# Altium schematic sheet esp8266.SchDoc
size A; SPICEModelCacheEUEXJSGD: <root> / <DocumentId>EUEXJSGD</DocumentId> / </root>
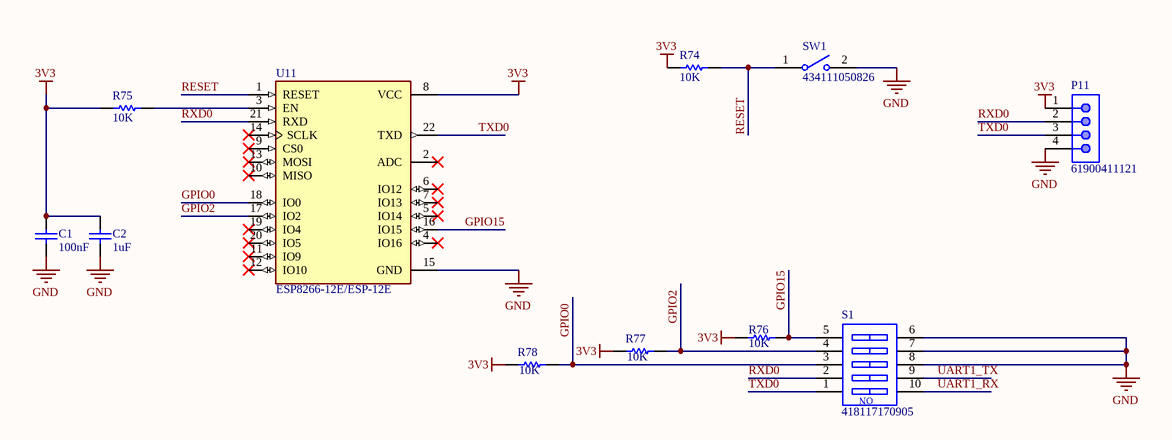
[diagram p0: esp8266.SchDoc]

## Parts
C1  value 100nF  [CAP-SM-0603]  (hidden comment: Cap Non-Pol SMD)
C2  value 1uF  [CAP-SM-0603]  (hidden comment: Cap Non-Pol SMD)
P11  61900411121  [61900411121]
R74  value 10K  [RES-SM-0603]  (hidden comment: RESISTOR SMD)
R75  value 10K  [RES-SM-0603]  (hidden comment: RESISTOR SMD)
R76  value 10K  [RES-SM-0603]  (hidden comment: RESISTOR SMD)
R77  value 10K  [RES-SM-0603]  (hidden comment: RESISTOR SMD)
R78  value 10K  [RES-SM-0603]  (hidden comment: RESISTOR SMD)
S1  418117170905  [418117170905]
SW1  434111050826  [WS-TASV_L6W3.5H5_4341x10508x6]
U11  ESP8266-12E/ESP-12E  [XCVR_ESP8266-12E/ESP-12E]

## Nets
3V3: C1.2 C2.2 P11.1 R74.1 R75.1 R76.2 R77.2 R78.2 U11.8(VCC)
GND: C1.1 C2.1 P11.4 S1.6 S1.7 S1.8 SW1.2 U11.15(GND)
GPIO0: R78.1 S1.3 U11.18(IO0)
GPIO2: R77.1 S1.4 U11.17(IO2)
GPIO15: R76.1 S1.5 U11.16(IO15)
RESET: R74.2 SW1.1 U11.1(RESET)
RXD0: P11.2 S1.2 U11.21(RXD)
TXD0: P11.3 S1.1 U11.22(TXD)
UART1_RX: S1.10
UART1_TX: S1.9
NetR75_2: R75.2 U11.3(EN)

Not connected (* = marked no-connect by the designer): U11 2(ADC)* 4(IO16)* 5(IO14)* 6(IO12)* 7(IO13)* 9(CS0)* 10(MISO)* 11(IO9)* 12(IO10)* 13(MOSI)* 14(SCLK)* 19(IO4)* 20(IO5)*

## Notes on the sheet
- (in symbol 418117170905) ON

## Library data of the parts
C1 C2 = Cap Non-Pol SMD: Capacitor
P11 = 61900411121: WR-WTB THT Male Vertical Locking Header, pitch 2.54mm, 4p; Pin Number: 4; Contact Resistance: 20mOhm; Rated Current: 3A; Withstanding Voltage: 1000VAC; Working Voltage: 250VAC; ComponentLink1Description: Manufacturer; ComponentLink1URL: http://www.we-online.de; ComponentLink2Description: Datasheet; ComponentLink2URL: https://www.we-online.com/catalog/datasheet/61900411121.pdf; Pitch: 2.54mm; Published Date: January 2020; Publisher: Wurth Elektronik; Mounting Technology: THT; Packaging: Bag; Operating Temperature: -40 to +105degC; Part Number: 61900411121; Gender: Male; Type: Vertical
R74-R78 = RESISTOR SMD: Resistor
S1 = 418117170905: WS-DITV Compact THT Dip Switch, Flat Actuator, pitch 2.54mm, 5p; Operation Force: 800g; Pole Number: 5; Actuator Type: Flat Type; Circuit: SPST-NO; Rated Current Switching: 25mA; Rated Current Non-Switching: 100mA; Rated Voltage Non-Switching: 50VDC; Rated Voltage Switching: 24VDC; ComponentLink1Description: Manufacturer; ComponentLink1URL: http://www.we-online.de; ComponentLink2Description: Datasheet; ComponentLink2URL: https://katalog.we-online.com/em/datasheet/418117170905.pdf; Pitch: 2.54mm; Contact Material: Copper Alloy; Mounting Technology: THT; Operating Temperature: -40 to +85degC; Contact Plating: Gold; Packaging: Tube; Part Number: 418117170905; Publisher: Wurth Elektronik; Published Date: September 2019
SW1 = 434111050826: WS-TASV SMT Tact Switch, 12VDC, 50mA, 260g, height 5mm; Manufacturer: Wurth Elektronik; Rated Voltage: 12V; Washable: No; Actuator Color: White; Electrical Life: 30000Cycles; ComponentLink1Description: Manufacturer Link; ComponentLink1URL: http://www.we-online.de; ComponentLink2Description: Datasheet; ComponentLink2URL: https://www.we-online.com/catalog/datasheet/434111050826.pdf; Manufacturer Part Number: 434111050826; Contact Material: Stainless Steel; Mounting Technology: SMT; Contact Plating: Silver; Operation Force: 260g; Packaging: Tape and Reel; Terminal Material: Copper Alloy; Rated Current: 50mA; Terminal Plating: Silver; Height: 5mm; Length: 6mm; Operating Temperature max.: 85C; Operating Temperature min.: -40C; Width: 3.5mm
U11 = ESP8266-12E/ESP-12E: ESP-12E WiFi Module; Value: *; MP: ESP8266-12E/ESP-12E; Availability: Unavailable; Package: None; Price: None